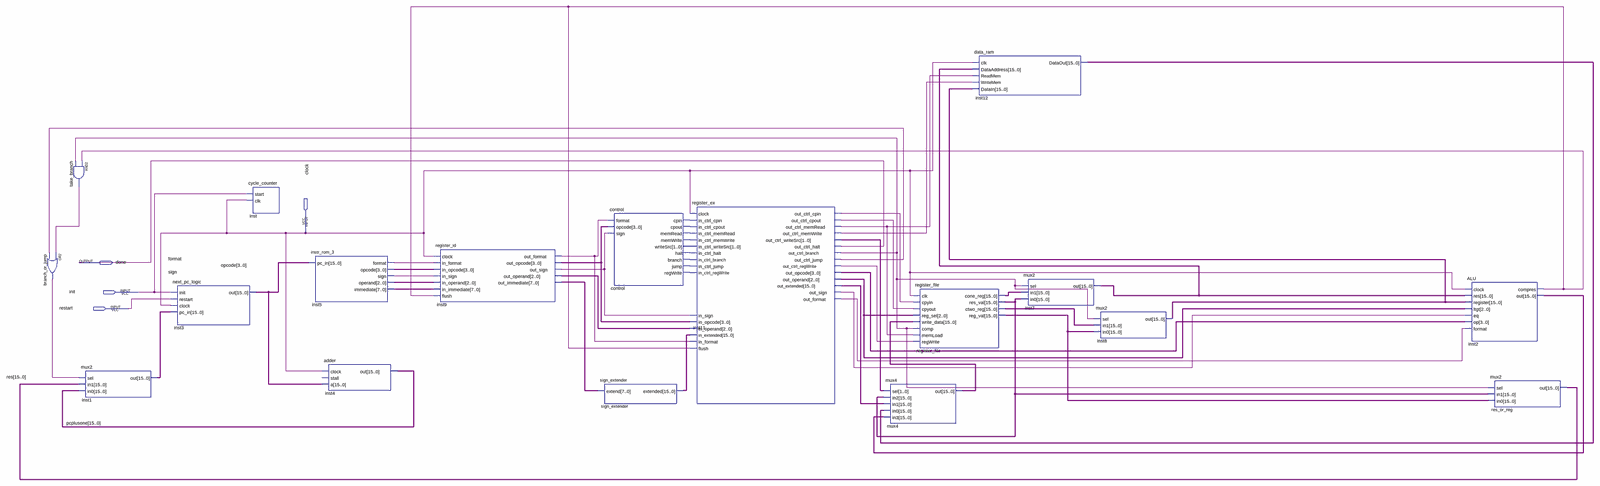
[diagram p0: schematic sheet, whole]
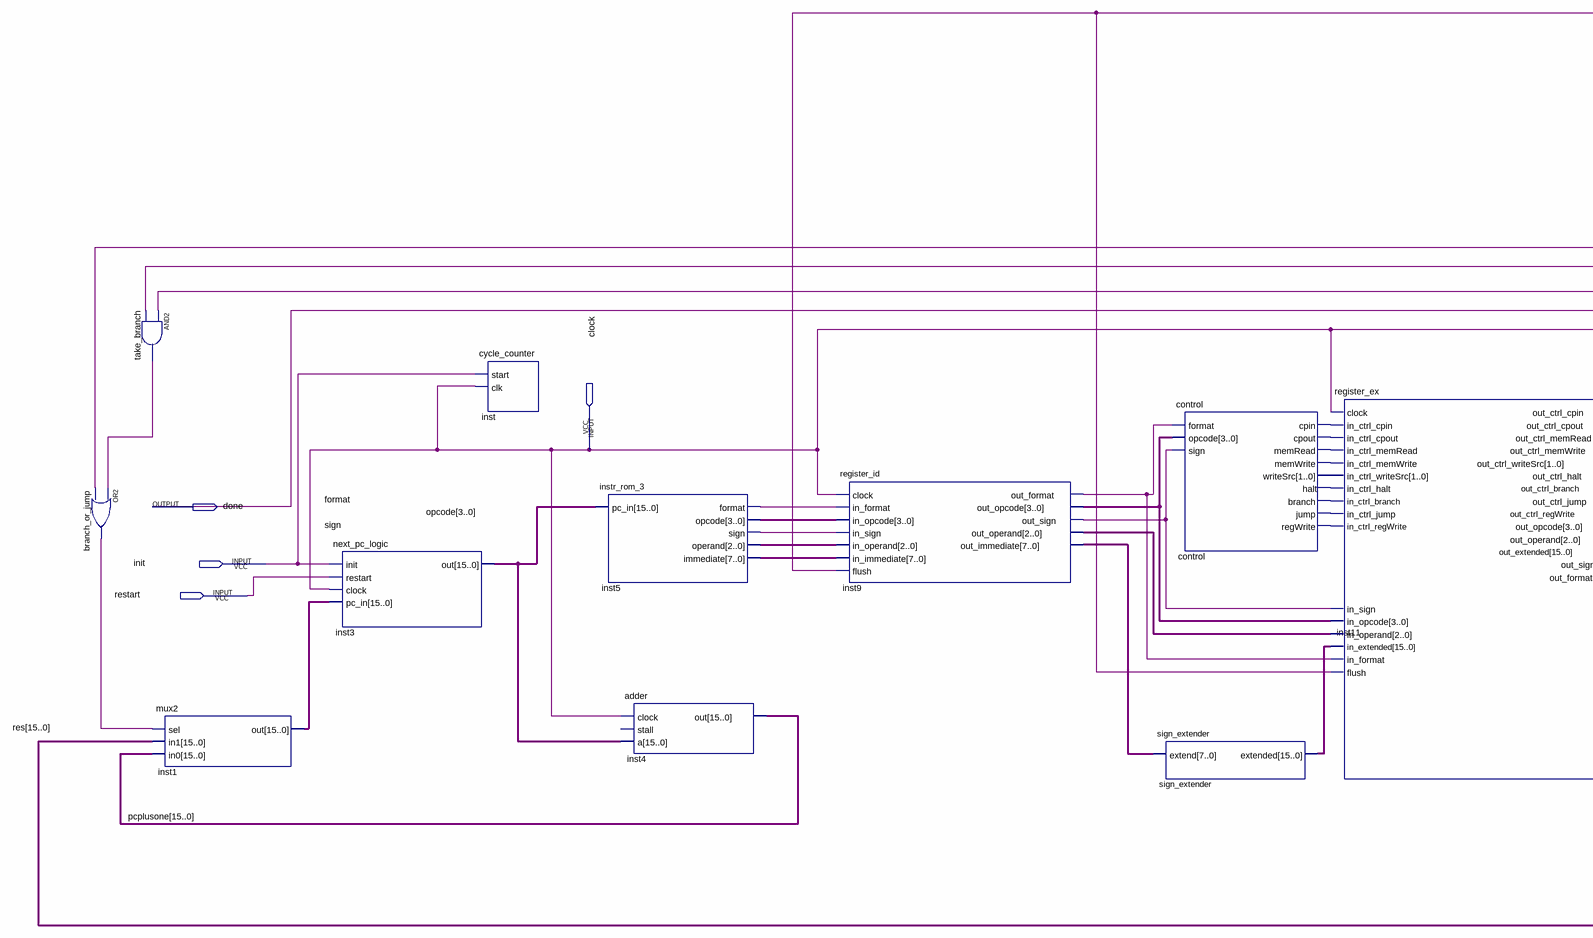
[diagram p1: schematic sheet, left part]
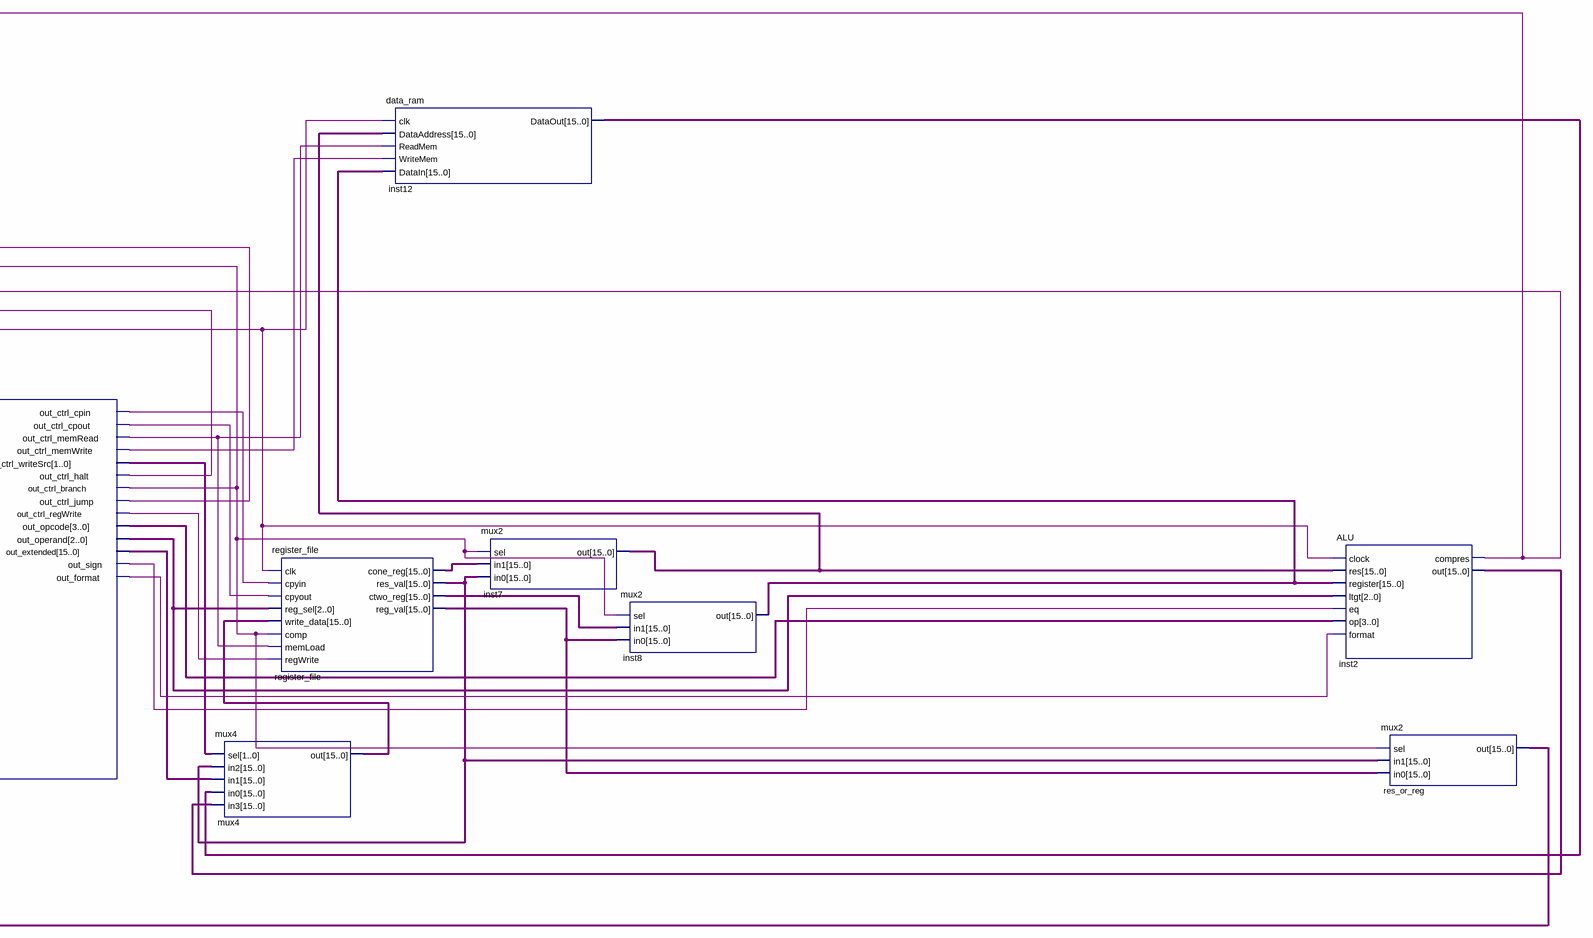
[diagram p2: schematic sheet, right part]
// Quartus schematic processor_3.bdf as structural Verilog: 18 symbols, 4 pins
module processor_3 (
  input  clock,
  input  init,
  input  restart,
  output done
);

  wire branch_or_jump_out, control_branch, control_cpin, control_cpout, control_halt, control_jump,
       control_memread, control_memwrite, control_regwrite, format, inst2_compres, inst9_out_format,
       inst9_out_sign, inst11_out_ctrl_branch, inst11_out_ctrl_cpin, inst11_out_ctrl_cpout,
       inst11_out_ctrl_jump, inst11_out_ctrl_memread, inst11_out_ctrl_memwrite, inst11_out_ctrl_regwrite,
       inst11_out_format, inst11_out_sign, sign, take_branch_out;
  wire [1:0] control_writesrc, inst11_out_ctrl_writesrc;
  wire [2:0] inst5_operand, inst9_out_operand, inst11_out_operand;
  wire [3:0] inst9_out_opcode, inst11_out_opcode, opcode;
  wire [7:0] inst5_immediate, inst9_out_immediate;
  wire [15:0] inst1_out, inst2_out, inst3_out, inst7_out, inst8_out, inst11_out_extended, inst12_dataout,
       mux4_out, pcplusone, register_file_cone_reg, register_file_ctwo_reg, register_file_reg_val,
       register_file_res_val, res, sign_extender_extended;

  or branch_or_jump (branch_or_jump_out, take_branch_out, inst11_out_ctrl_jump);
  and take_branch (take_branch_out, inst2_compres, inst11_out_ctrl_branch);
  mux2 inst1 (.sel(branch_or_jump_out), .in1(res), .in0(pcplusone), .out(inst1_out));
  next_pc_logic inst3 (.init(init), .restart(restart), .clock(clock), .pc_in(inst1_out), .out(inst3_out));
  cycle_counter inst (.start(init), .clk(clock));
  instr_rom_3 inst5 (
    .pc_in(inst3_out), .format(format), .opcode(opcode), .sign(sign), .operand(inst5_operand),
    .immediate(inst5_immediate));
  adder inst4 (.clock(clock), .a(inst3_out), .out(pcplusone));  // open: stall
  register_id inst9 (
    .clock(clock), .in_format(format), .in_opcode(opcode), .in_sign(sign), .in_operand(inst5_operand),
    .in_immediate(inst5_immediate), .flush(inst2_compres), .out_format(inst9_out_format),
    .out_opcode(inst9_out_opcode), .out_sign(inst9_out_sign), .out_operand(inst9_out_operand),
    .out_immediate(inst9_out_immediate));
  sign_extender sign_extender (.extend(inst9_out_immediate), .extended(sign_extender_extended));
  control control (
    .format(inst9_out_format), .opcode(inst9_out_opcode), .sign(inst9_out_sign), .cpin(control_cpin),
    .cpout(control_cpout), .memRead(control_memread), .memWrite(control_memwrite),
    .writeSrc(control_writesrc), .halt(control_halt), .branch(control_branch), .jump(control_jump),
    .regWrite(control_regwrite));
  register_ex inst11 (
    .clock(clock), .in_ctrl_cpin(control_cpin), .in_ctrl_cpout(control_cpout),
    .in_ctrl_memRead(control_memread), .in_ctrl_memWrite(control_memwrite),
    .in_ctrl_writeSrc(control_writesrc), .in_ctrl_halt(control_halt), .in_ctrl_branch(control_branch),
    .in_ctrl_jump(control_jump), .in_ctrl_regWrite(control_regwrite), .in_sign(inst9_out_sign),
    .in_opcode(inst9_out_opcode), .in_operand(inst9_out_operand), .in_extended(sign_extender_extended),
    .in_format(inst9_out_format), .flush(inst2_compres), .out_ctrl_cpin(inst11_out_ctrl_cpin),
    .out_ctrl_cpout(inst11_out_ctrl_cpout), .out_ctrl_memRead(inst11_out_ctrl_memread),
    .out_ctrl_memWrite(inst11_out_ctrl_memwrite), .out_ctrl_writeSrc(inst11_out_ctrl_writesrc),
    .out_ctrl_halt(done), .out_ctrl_branch(inst11_out_ctrl_branch), .out_ctrl_jump(inst11_out_ctrl_jump),
    .out_ctrl_regWrite(inst11_out_ctrl_regwrite), .out_opcode(inst11_out_opcode),
    .out_operand(inst11_out_operand), .out_extended(inst11_out_extended), .out_sign(inst11_out_sign),
    .out_format(inst11_out_format));
  mux4 mux4 (
    .sel(inst11_out_ctrl_writesrc), .in2(register_file_res_val), .in1(inst11_out_extended),
    .in0(inst12_dataout), .in3(inst2_out), .out(mux4_out));
  register_file register_file (
    .clk(clock), .cpyin(inst11_out_ctrl_cpin), .cpyout(inst11_out_ctrl_cpout), .reg_sel(inst11_out_operand),
    .write_data(mux4_out), .comp(inst11_out_ctrl_branch), .memLoad(inst11_out_ctrl_memread),
    .regWrite(inst11_out_ctrl_regwrite), .cone_reg(register_file_cone_reg), .res_val(register_file_res_val),
    .ctwo_reg(register_file_ctwo_reg), .reg_val(register_file_reg_val));
  data_ram inst12 (
    .clk(clock), .DataAddress(inst7_out), .ReadMem(inst11_out_ctrl_memread),
    .WriteMem(inst11_out_ctrl_memwrite), .DataIn(inst8_out), .DataOut(inst12_dataout));
  mux2 inst7 (.sel(inst11_out_ctrl_branch), .in1(register_file_cone_reg), .in0(register_file_res_val), .out(inst7_out));
  mux2 inst8 (.sel(inst11_out_ctrl_branch), .in1(register_file_ctwo_reg), .in0(register_file_reg_val), .out(inst8_out));
  ALU inst2 (
    .clock(clock), .res(inst7_out), .register(inst8_out), .ltgt(inst11_out_operand), .eq(inst11_out_sign),
    .op(inst11_out_opcode), .format(inst11_out_format), .compres(inst2_compres), .out(inst2_out));
  mux2 res_or_reg (.sel(inst11_out_ctrl_branch), .in1(register_file_res_val), .in0(register_file_reg_val), .out(res));
endmodule
